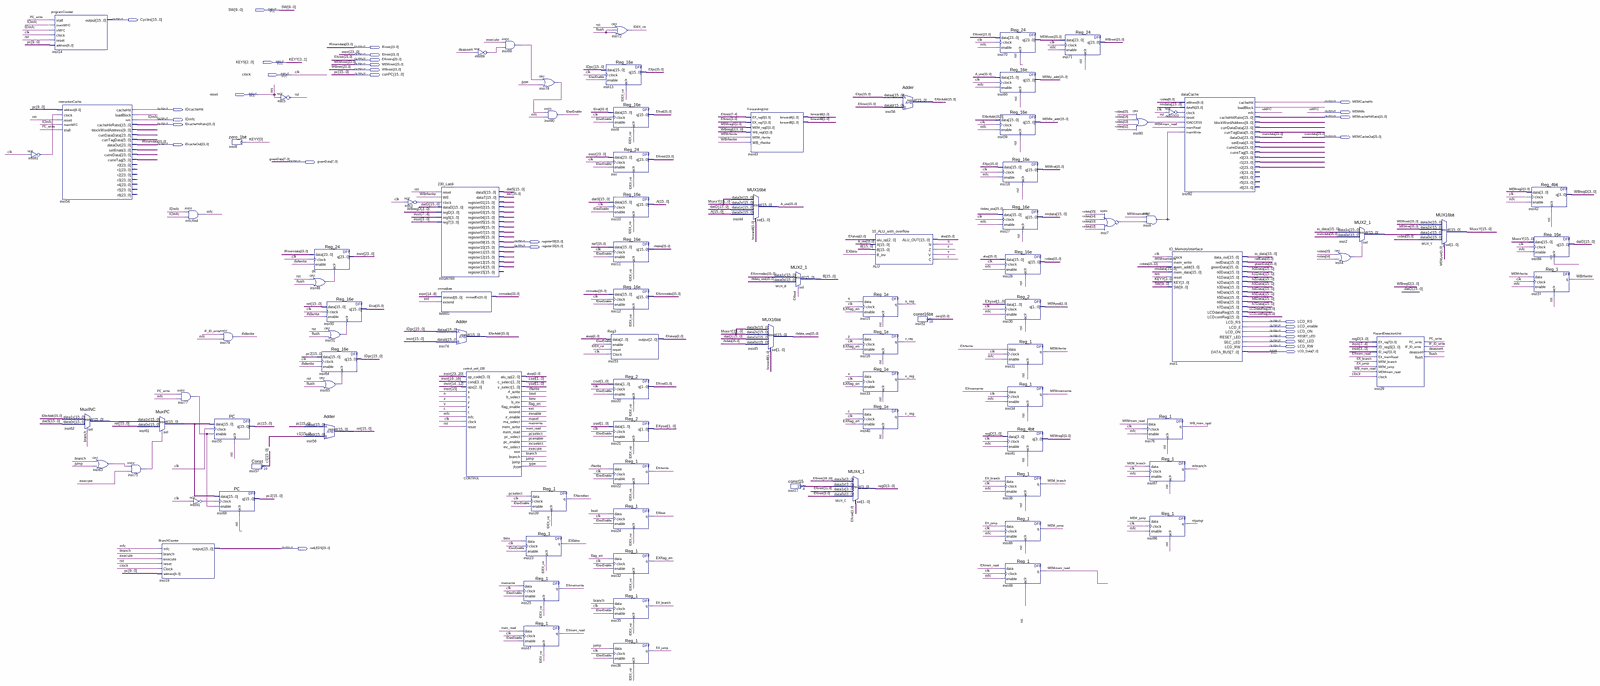
[diagram p0: schematic sheet, whole]
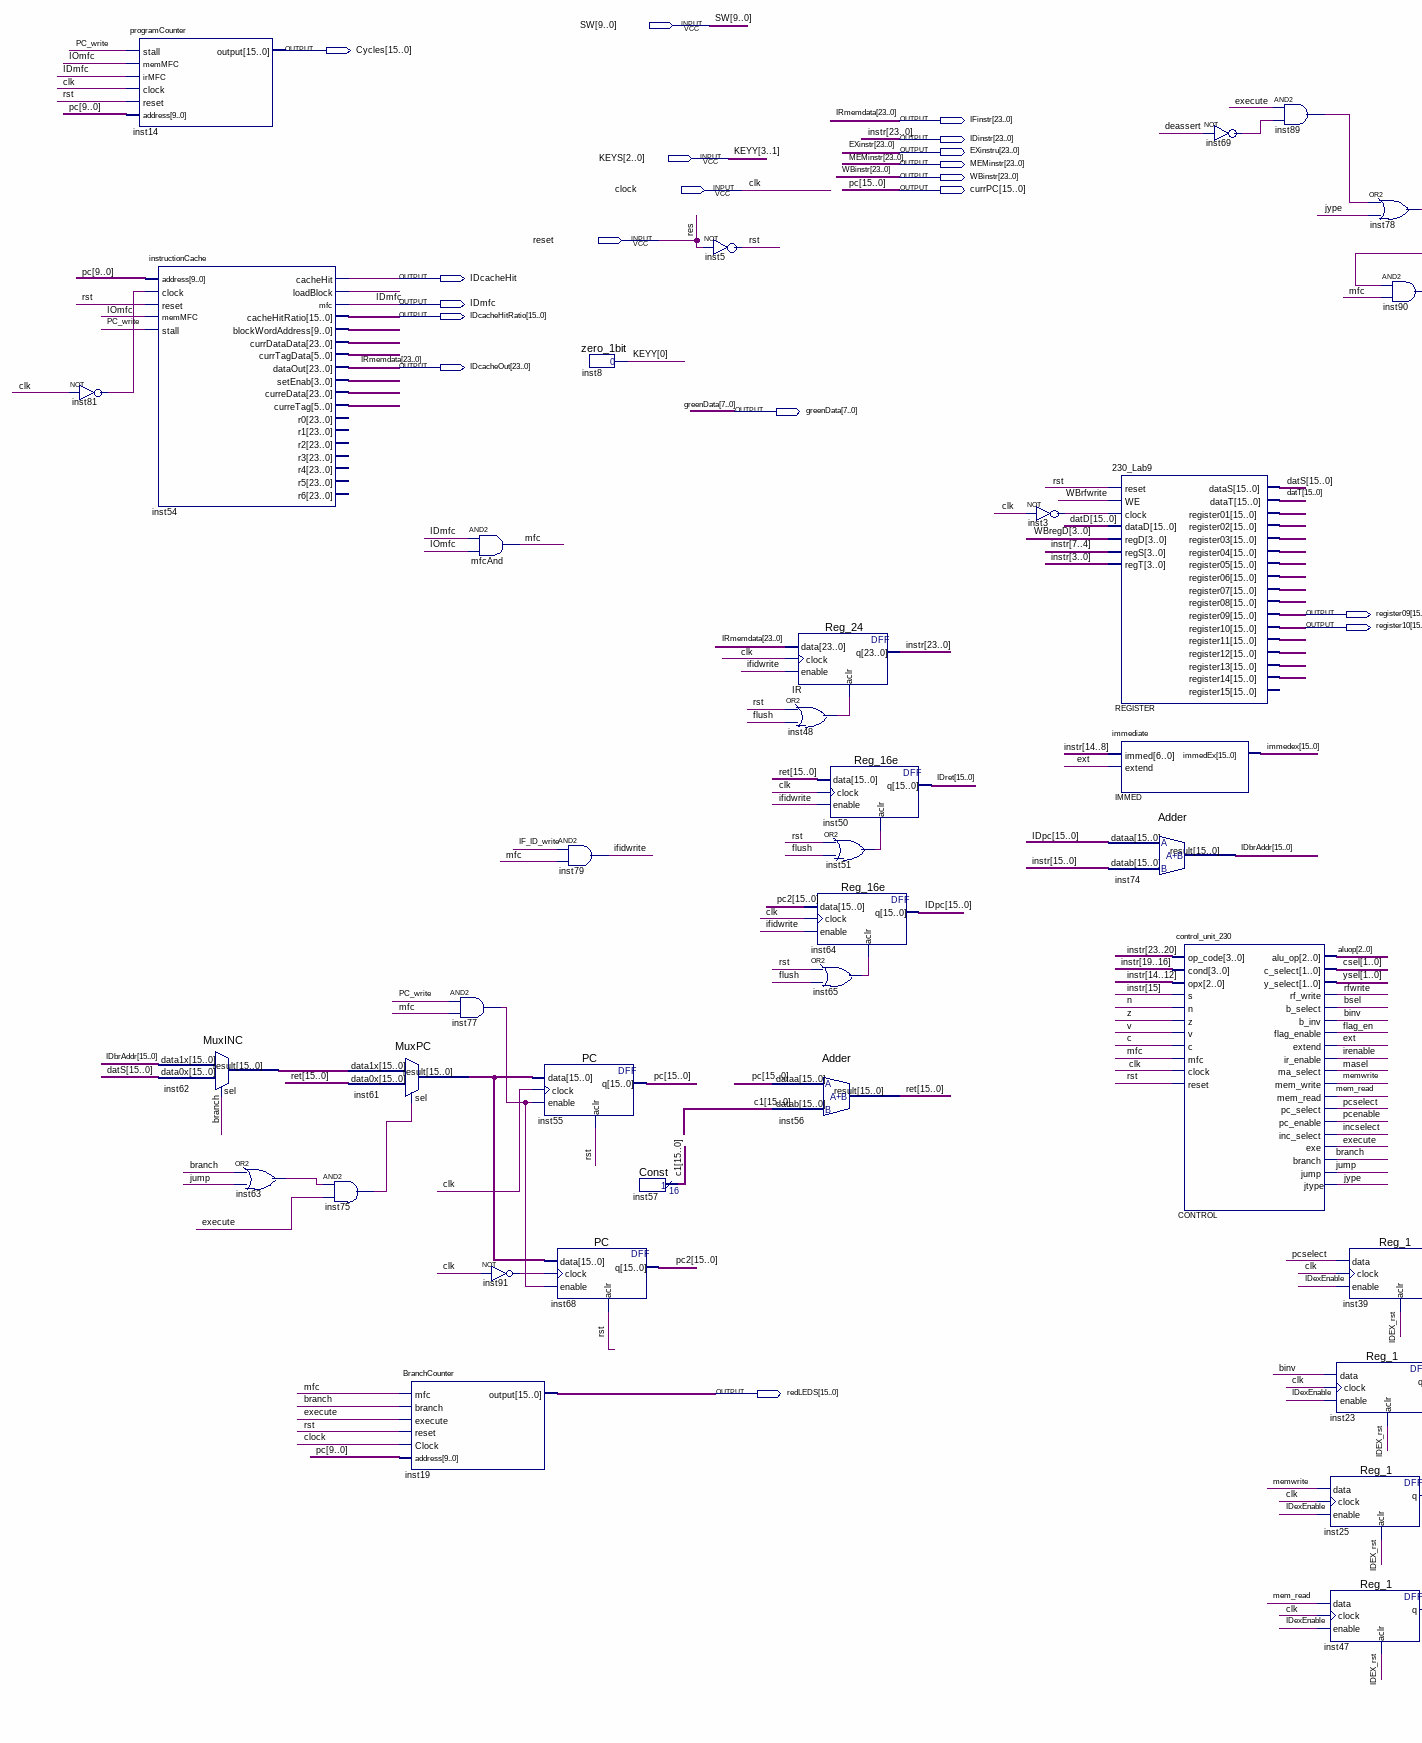
[diagram p1: schematic sheet, left part]
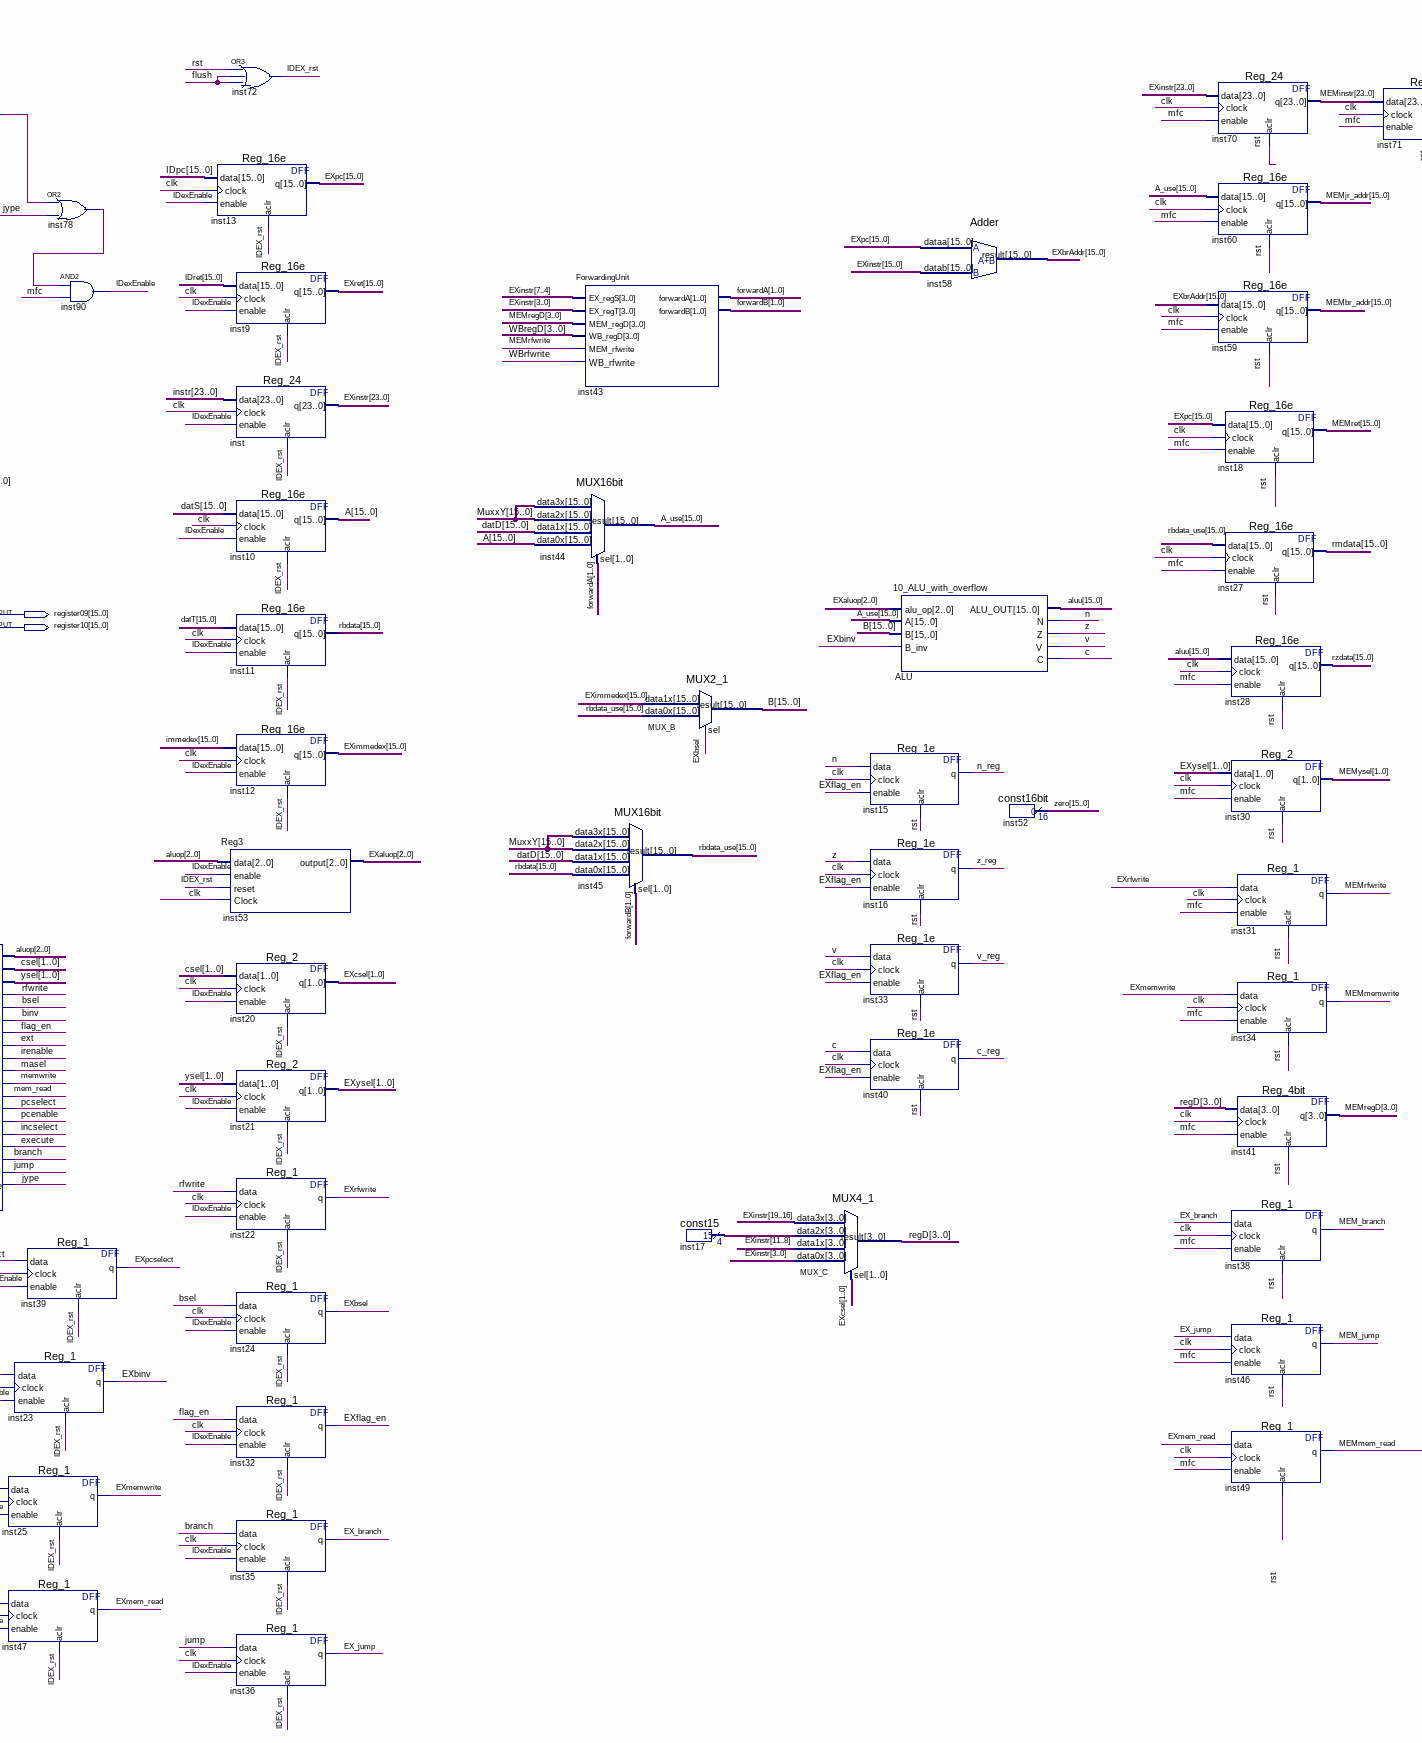
[diagram p2: schematic sheet, centre part]
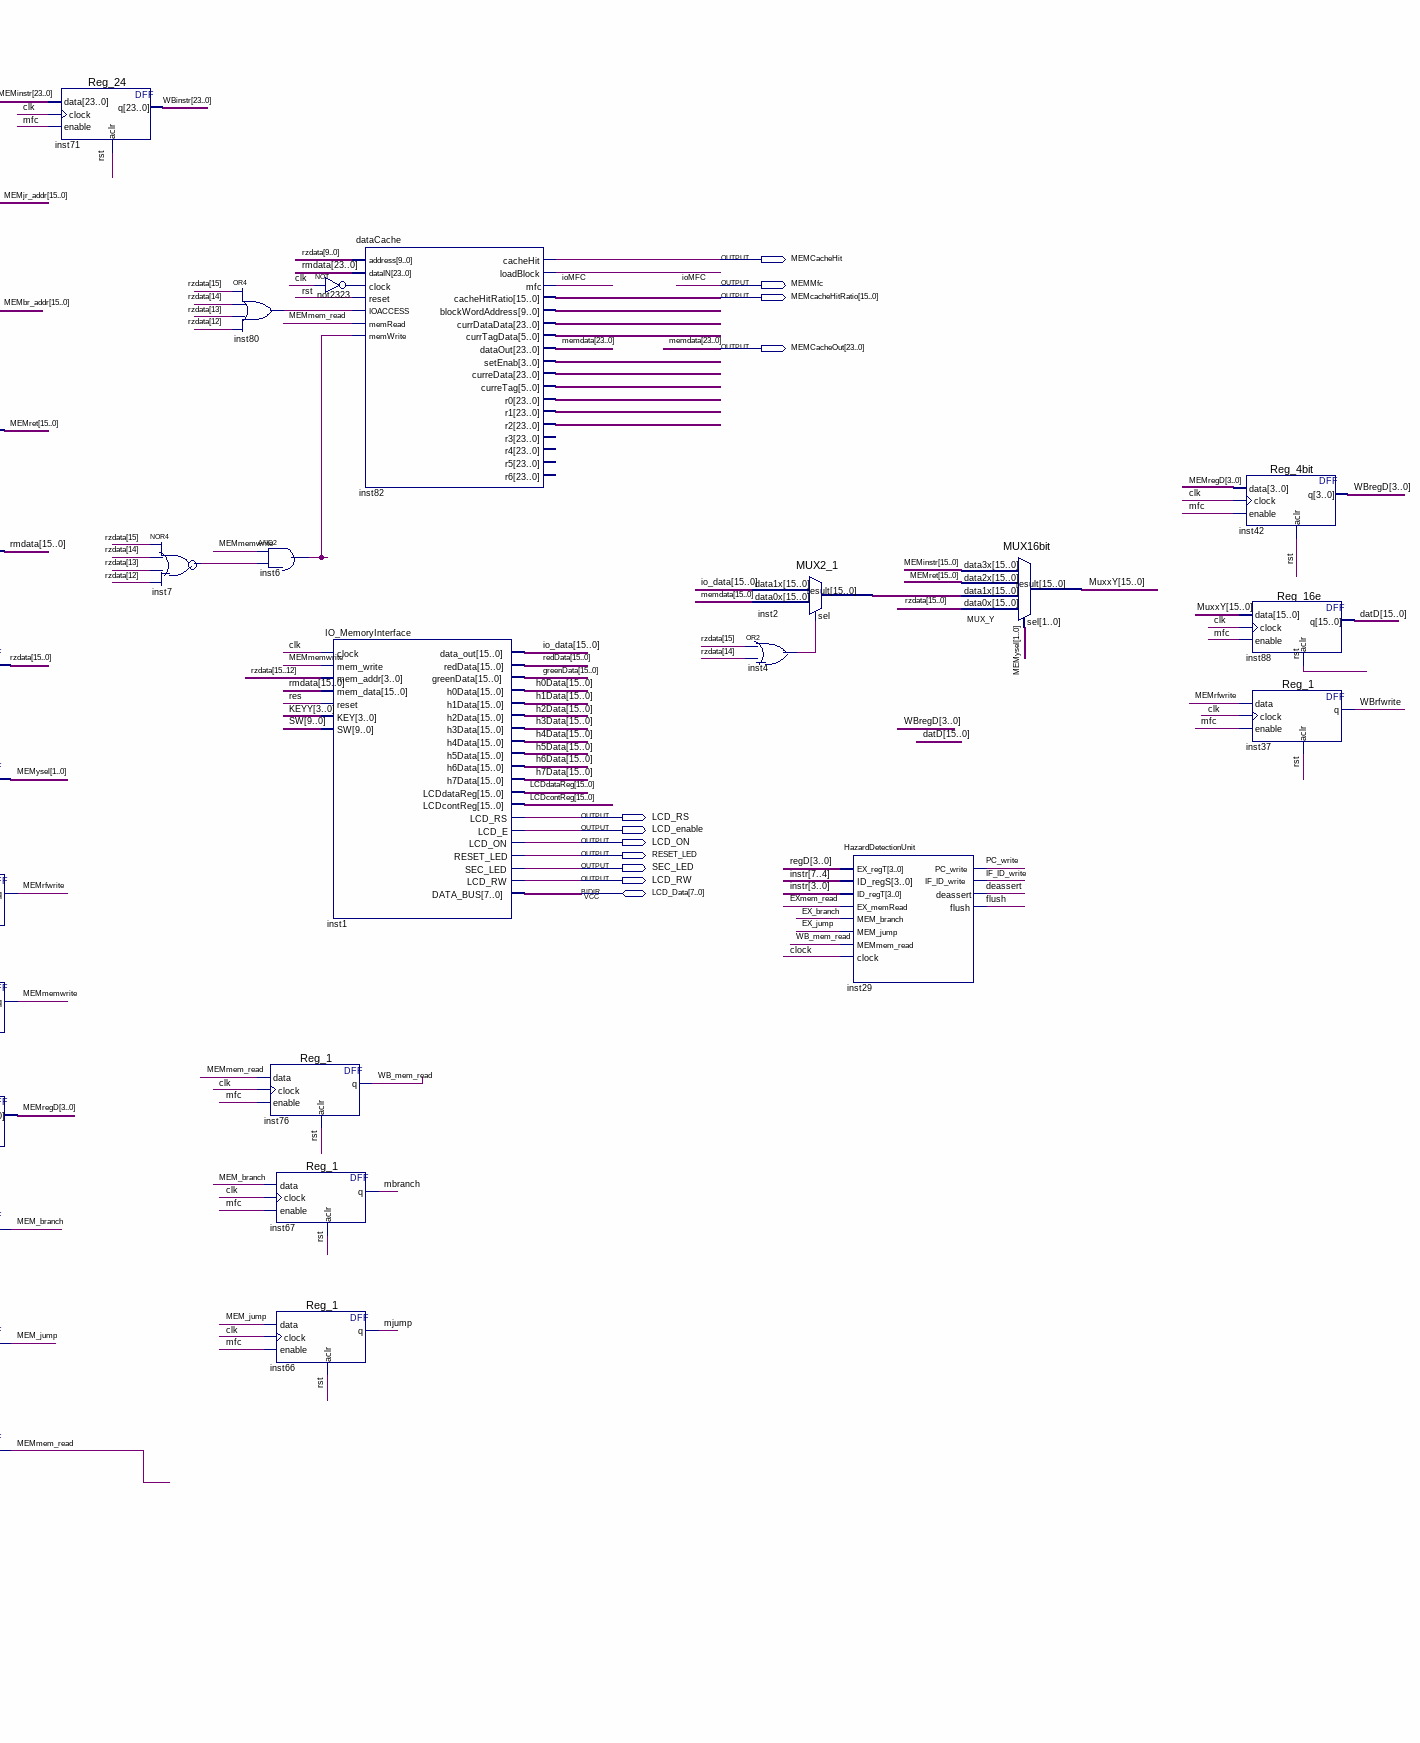
[diagram p3: schematic sheet, right part]
// Quartus schematic processor.bdf as structural Verilog: 95 symbols, 30 pins
module processor (
  input  [9:0] SW,
  input  [2:0] KEYS,
  input  clock,
  input  reset,
  inout  [7:0] LCD_Data,
  output [15:0] Cycles,
  output [23:0] IFinstr,
  output [23:0] IDinstr,
  output [23:0] EXinstru,
  output [23:0] MEMinstr,
  output [23:0] WBinstr,
  output [15:0] currPC,
  output MEMCacheHit,
  output IDcacheHit,
  output MEMMfc,
  output [15:0] MEMcacheHitRatio,
  output IDmfc,
  output [15:0] IDcacheHitRatio,
  output [23:0] MEMCacheOut,
  output [23:0] IDcacheOut,
  output [15:0] greenData,
  output [15:0] register09,
  output [15:0] register10,
  output LCD_RS,
  output LCD_enable,
  output LCD_ON,
  output RESET_LED,
  output SEC_LED,
  output LCD_RW,
  output [15:0] redLEDS
);

  wire binv, branch, bsel, c, c_reg, deassert, EX_branch, EX_jump, EXbinv, EXbsel, execute, EXflag_en,
       EXmem_read, EXmemwrite, EXpcselect, EXrfwrite, ext, flag_en, flush, IDEX_rst, IDexEnable, IF_ID_write,
       ifidwrite, incselect, inst3_out, inst4_out, inst6_out, inst7_out, inst48_out, inst51_out,
       inst54_loadblock, inst63_out, inst65_out, inst69_out, inst75_out, inst77_out, inst78_out, inst80_out,
       inst81_out, inst82_loadblock, inst89_out, inst91_out, irenable, jump, jype, masel, mbranch,
       MEM_branch, MEM_jump, mem_read, MEMmem_read, MEMmemwrite, MEMrfwrite, memwrite, mfc, mjump, n, n_reg,
       not2323_out, PC_write, pcenable, pcselect, rfwrite, rst, v, v_reg, WB_mem_read, WBrfwrite, z, z_reg;
  wire [0:0] KEYY;
  wire [1:0] csel, EXcsel, EXysel, forwardA, forwardB, MEMysel, ysel;
  wire [2:0] aluop, EXaluop;
  wire [3:0] inst17_result, inst54_setenab, inst82_setenab, MEMregD, regD, WBregD;
  wire [5:0] inst54_curretag, inst54_currtagdata, inst82_curretag, inst82_currtagdata;
  wire [9:0] inst54_blockwordaddress, inst82_blockwordaddress;
  wire [15:0] A, A_use, aluu, B, c1, datD, datS, datT, EXbrAddr, EXimmedex, EXpc, EXret, h0Data, h1Data,
       h2Data, h3Data, h4Data, h5Data, h6Data, h7Data, IDbrAddr, IDpc, IDret, immedex, inst2_result,
       inst61_result, inst62_result, io_data, LCDcontReg, LCDdataReg, MEMbr_addr, MEMjr_addr, MEMret, MuxxY,
       pc2, rbdata, rbdata_use, redData, REGISTER_register01, REGISTER_register02, REGISTER_register03,
       REGISTER_register04, REGISTER_register05, REGISTER_register06, REGISTER_register07,
       REGISTER_register08, REGISTER_register11, REGISTER_register12, REGISTER_register13,
       REGISTER_register14, ret, rzdata, zero;
  wire [23:0] inst54_currdatadata, inst54_curredata, inst82_currdatadata, inst82_curredata, inst82_r0,
       inst82_r1, inst82_r2, rmdata;

  not inst81 (inst81_out, clock);
  programCounter inst14 (
    .stall(PC_write), .memMFC(MEMMfc), .irMFC(IDmfc), .clock(clock), .reset(rst), .address(currPC[9:0]),
    .\output (Cycles));
  instructionCache inst54 (
    .address(currPC[9:0]), .clock(inst81_out), .reset(rst), .memMFC(MEMMfc), .stall(PC_write),
    .cacheHit(IDcacheHit), .loadBlock(inst54_loadblock), .mfc(IDmfc), .cacheHitRatio(IDcacheHitRatio),
    .blockWordAddress(inst54_blockwordaddress), .currDataData(inst54_currdatadata),
    .currTagData(inst54_currtagdata), .dataOut(IDcacheOut), .setEnab(inst54_setenab),
    .curreData(inst54_curredata), .curreTag(inst54_curretag));  // open: r0, r1, r2, r3, r4, r5, r6
  MuxINC inst62 (.data1x(IDbrAddr), .data0x(datS), .sel(branch), .result(inst62_result));
  or inst63 (inst63_out, branch, jump);
  and inst75 (inst75_out, inst63_out, execute);
  MuxPC inst61 (.data1x(inst62_result), .data0x(ret), .sel(inst75_out), .result(inst61_result));
  BranchCounter inst19 (
    .mfc(mfc), .branch(branch), .execute(execute), .reset(rst), .Clock(clock), .address(currPC[9:0]),
    .\output (redLEDS));
  and mfcAnd (mfc, IDmfc, MEMMfc);
  and inst77 (inst77_out, PC_write, mfc);
  not inst91 (inst91_out, clock);
  PC inst55 (.data(inst61_result), .clock(clock), .enable(inst77_out), .aclr(rst), .q(currPC));
  PC inst68 (.data(inst61_result), .clock(inst91_out), .enable(inst77_out), .aclr(rst), .q(pc2));
  zero_1bit inst8 (.result(KEYY[0]));
  and inst79 (ifidwrite, IF_ID_write, mfc);
  Const inst57 (.result(c1));
  not inst5 (rst, reset);
  Reg_24 IR (.data(IDcacheOut), .clock(clock), .enable(ifidwrite), .aclr(inst48_out), .q(IDinstr));
  or inst48 (inst48_out, rst, flush);
  Adder inst56 (.dataa(currPC), .datab(c1), .result(ret));
  Reg_16e inst50 (.data(ret), .clock(clock), .enable(ifidwrite), .aclr(inst51_out), .q(IDret));
  or inst51 (inst51_out, rst, flush);
  Reg_16e inst64 (.data(pc2), .clock(clock), .enable(ifidwrite), .aclr(inst65_out), .q(IDpc));
  or inst65 (inst65_out, rst, flush);
  not inst3 (inst3_out, clock);
  \230_Lab9  REGISTER (
    .reset(rst), .WE(WBrfwrite), .clock(inst3_out), .dataD(datD), .regD(WBregD), .regS(IDinstr[7:4]),
    .regT(IDinstr[3:0]), .dataS(datS), .dataT(datT), .register01(REGISTER_register01),
    .register02(REGISTER_register02), .register03(REGISTER_register03), .register04(REGISTER_register04),
    .register05(REGISTER_register05), .register06(REGISTER_register06), .register07(REGISTER_register07),
    .register08(REGISTER_register08), .register09(register09), .register10(register10),
    .register11(REGISTER_register11), .register12(REGISTER_register12), .register13(REGISTER_register13),
    .register14(REGISTER_register14));  // open: register15
  immediate IMMED (.immed(IDinstr[14:8]), .extend(ext), .immedEx(immedex));
  Adder inst74 (.dataa(IDpc), .datab(IDinstr[15:0]), .result(IDbrAddr));
  not inst69 (inst69_out, deassert);
  control_unit_230 CONTROL (
    .op_code(IDinstr[23:20]), .cond(IDinstr[19:16]), .opx(IDinstr[14:12]), .s(IDinstr[15]), .n(n), .z(z),
    .v(v), .c(c), .mfc(mfc), .clock(clock), .reset(rst), .alu_op(aluop), .c_select(csel), .y_select(ysel),
    .rf_write(rfwrite), .b_select(bsel), .b_inv(binv), .flag_enable(flag_en), .extend(ext),
    .ir_enable(irenable), .ma_select(masel), .mem_write(memwrite), .mem_read(mem_read), .pc_select(pcselect),
    .pc_enable(pcenable), .inc_select(incselect), .exe(execute), .branch(branch), .jump(jump), .jtype(jype));
  and inst89 (inst89_out, execute, inst69_out);
  Reg_1 inst39 (.data(pcselect), .clock(clock), .enable(IDexEnable), .aclr(IDEX_rst), .q(EXpcselect));
  Reg_1 inst23 (.data(binv), .clock(clock), .enable(IDexEnable), .aclr(IDEX_rst), .q(EXbinv));
  Reg_1 inst25 (.data(memwrite), .clock(clock), .enable(IDexEnable), .aclr(IDEX_rst), .q(EXmemwrite));
  Reg_1 inst47 (.data(mem_read), .clock(clock), .enable(IDexEnable), .aclr(IDEX_rst), .q(EXmem_read));
  or inst78 (inst78_out, inst89_out, jype);
  and inst90 (IDexEnable, inst78_out, mfc);
  or inst72 (IDEX_rst, rst, flush, flush);
  Reg_16e inst13 (.data(IDpc), .clock(clock), .enable(IDexEnable), .aclr(IDEX_rst), .q(EXpc));
  Reg_16e inst9 (.data(IDret), .clock(clock), .enable(IDexEnable), .aclr(IDEX_rst), .q(EXret));
  Reg_24 inst (.data(IDinstr), .clock(clock), .enable(IDexEnable), .aclr(IDEX_rst), .q(EXinstru));
  Reg_16e inst10 (.data(datS), .clock(clock), .enable(IDexEnable), .aclr(IDEX_rst), .q(A));
  Reg_16e inst11 (.data(datT), .clock(clock), .enable(IDexEnable), .aclr(IDEX_rst), .q(rbdata));
  Reg_16e inst12 (.data(immedex), .clock(clock), .enable(IDexEnable), .aclr(IDEX_rst), .q(EXimmedex));
  Reg3 inst53 (.data(aluop), .enable(IDexEnable), .reset(IDEX_rst), .Clock(clock), .\output (EXaluop));
  Reg_2 inst20 (.data(csel), .clock(clock), .enable(IDexEnable), .aclr(IDEX_rst), .q(EXcsel));
  Reg_2 inst21 (.data(ysel), .clock(clock), .enable(IDexEnable), .aclr(IDEX_rst), .q(EXysel));
  Reg_1 inst22 (.data(rfwrite), .clock(clock), .enable(IDexEnable), .aclr(IDEX_rst), .q(EXrfwrite));
  Reg_1 inst24 (.data(bsel), .clock(clock), .enable(IDexEnable), .aclr(IDEX_rst), .q(EXbsel));
  Reg_1 inst32 (.data(flag_en), .clock(clock), .enable(IDexEnable), .aclr(IDEX_rst), .q(EXflag_en));
  Reg_1 inst35 (.data(branch), .clock(clock), .enable(IDexEnable), .aclr(IDEX_rst), .q(EX_branch));
  Reg_1 inst36 (.data(jump), .clock(clock), .enable(IDexEnable), .aclr(IDEX_rst), .q(EX_jump));
  MUX16bit inst44 (.data3x(MuxxY), .data2x(MuxxY), .data1x(datD), .data0x(A), .sel(forwardA), .result(A_use));
  ForwardingUnit inst43 (
    .EX_regS(EXinstru[7:4]), .EX_regT(EXinstru[3:0]), .MEM_regD(MEMregD), .WB_regD(WBregD),
    .MEM_rfwrite(MEMrfwrite), .WB_rfwrite(WBrfwrite), .forwardA(forwardA), .forwardB(forwardB));
  MUX16bit inst45 (.data3x(MuxxY), .data2x(MuxxY), .data1x(datD), .data0x(rbdata), .sel(forwardB), .result(rbdata_use));
  MUX2_1 MUX_B (.data1x(EXimmedex), .data0x(rbdata_use), .sel(EXbsel), .result(B));
  const15 inst17 (.result(inst17_result));
  MUX4_1 MUX_C (
    .data3x(EXinstru[19:16]), .data2x(inst17_result), .data1x(EXinstru[11:8]), .data0x(EXinstru[3:0]),
    .sel(EXcsel), .result(regD));
  \10_ALU_with_overflow  ALU (
    .alu_op(EXaluop), .A(A_use), .B(B), .B_inv(EXbinv), .ALU_OUT(aluu), .N(n), .Z(z), .V(v), .C(c));
  Reg_1e inst15 (.data(n), .clock(clock), .enable(EXflag_en), .aclr(rst), .q(n_reg));
  Reg_1e inst16 (.data(z), .clock(clock), .enable(EXflag_en), .aclr(rst), .q(z_reg));
  Reg_1e inst33 (.data(v), .clock(clock), .enable(EXflag_en), .aclr(rst), .q(v_reg));
  Reg_1e inst40 (.data(c), .clock(clock), .enable(EXflag_en), .aclr(rst), .q(c_reg));
  Adder inst58 (.dataa(EXpc), .datab(EXinstru[15:0]), .result(EXbrAddr));
  const16bit inst52 (.result(zero));
  Reg_24 inst70 (.data(EXinstru), .clock(clock), .enable(mfc), .aclr(rst), .q(MEMinstr));
  Reg_16e inst60 (.data(A_use), .clock(clock), .enable(mfc), .aclr(rst), .q(MEMjr_addr));
  Reg_16e inst59 (.data(EXbrAddr), .clock(clock), .enable(mfc), .aclr(rst), .q(MEMbr_addr));
  Reg_16e inst18 (.data(EXpc), .clock(clock), .enable(mfc), .aclr(rst), .q(MEMret));
  Reg_16e inst27 (.data(rbdata_use), .clock(clock), .enable(mfc), .aclr(rst), .q(rmdata[15:0]));
  Reg_16e inst28 (.data(aluu), .clock(clock), .enable(mfc), .aclr(rst), .q(rzdata));
  Reg_2 inst30 (.data(EXysel), .clock(clock), .enable(mfc), .aclr(rst), .q(MEMysel));
  Reg_1 inst31 (.data(EXrfwrite), .clock(clock), .enable(mfc), .aclr(rst), .q(MEMrfwrite));
  Reg_1 inst34 (.data(EXmemwrite), .clock(clock), .enable(mfc), .aclr(rst), .q(MEMmemwrite));
  Reg_4bit inst41 (.data(regD), .clock(clock), .enable(mfc), .aclr(rst), .q(MEMregD));
  Reg_1 inst38 (.data(EX_branch), .clock(clock), .enable(mfc), .aclr(rst), .q(MEM_branch));
  Reg_1 inst46 (.data(EX_jump), .clock(clock), .enable(mfc), .aclr(rst), .q(MEM_jump));
  Reg_1 inst49 (.data(EXmem_read), .clock(clock), .enable(mfc), .aclr(rst), .q(MEMmem_read));
  Reg_24 inst71 (.data(MEMinstr), .clock(clock), .enable(mfc), .aclr(rst), .q(WBinstr));
  nor inst7 (inst7_out, rzdata[15], rzdata[14], rzdata[13], rzdata[12]);
  or inst80 (inst80_out, rzdata[15], rzdata[14], rzdata[13], rzdata[12]);
  and inst6 (inst6_out, MEMmemwrite, inst7_out);
  Reg_1 inst76 (.data(MEMmem_read), .clock(clock), .enable(mfc), .aclr(rst), .q(WB_mem_read));
  Reg_1 inst67 (.data(MEM_branch), .clock(clock), .enable(mfc), .aclr(rst), .q(mbranch));
  Reg_1 inst66 (.data(MEM_jump), .clock(clock), .enable(mfc), .aclr(rst), .q(mjump));
  not not2323 (not2323_out, clock);
  IO_MemoryInterface inst1 (
    .clock(clock), .mem_write(MEMmemwrite), .mem_addr(rzdata[15:12]), .mem_data(rmdata[15:0]), .reset(reset),
    .KEY({KEYS, KEYY[0]}), .SW(SW), .data_out(io_data), .redData(redData), .greenData(greenData),
    .h0Data(h0Data), .h1Data(h1Data), .h2Data(h2Data), .h3Data(h3Data), .h4Data(h4Data), .h5Data(h5Data),
    .h6Data(h6Data), .h7Data(h7Data), .LCDdataReg(LCDdataReg), .LCDcontReg(LCDcontReg), .LCD_RS(LCD_RS),
    .LCD_E(LCD_enable), .LCD_ON(LCD_ON), .RESET_LED(RESET_LED), .SEC_LED(SEC_LED), .LCD_RW(LCD_RW),
    .DATA_BUS(LCD_Data));
  dataCache inst82 (
    .address(rzdata[9:0]), .dataIN(rmdata), .clock(not2323_out), .reset(rst), .IOACCESS(inst80_out),
    .memRead(MEMmem_read), .memWrite(inst6_out), .cacheHit(MEMCacheHit), .loadBlock(inst82_loadblock),
    .mfc(MEMMfc), .cacheHitRatio(MEMcacheHitRatio), .blockWordAddress(inst82_blockwordaddress),
    .currDataData(inst82_currdatadata), .currTagData(inst82_currtagdata), .dataOut(MEMCacheOut),
    .setEnab(inst82_setenab), .curreData(inst82_curredata), .curreTag(inst82_curretag), .r0(inst82_r0),
    .r1(inst82_r1), .r2(inst82_r2));  // open: r3, r4, r5, r6
  MUX2_1 inst2 (.data1x(io_data), .data0x(MEMCacheOut[15:0]), .sel(inst4_out), .result(inst2_result));
  or inst4 (inst4_out, rzdata[15], rzdata[14]);
  HazardDetectionUnit inst29 (
    .EX_regT(regD), .ID_regS(IDinstr[7:4]), .ID_regT(IDinstr[3:0]), .EX_memRead(EXmem_read),
    .MEM_branch(EX_branch), .MEM_jump(EX_jump), .MEMmem_read(WB_mem_read), .clock(clock),
    .PC_write(PC_write), .IF_ID_write(IF_ID_write), .deassert(deassert), .flush(flush));
  MUX16bit MUX_Y (
    .data3x(MEMinstr[15:0]), .data2x(MEMret), .data1x(inst2_result), .data0x(rzdata), .sel(MEMysel),
    .result(MuxxY));
  Reg_4bit inst42 (.data(MEMregD), .clock(clock), .enable(mfc), .aclr(rst), .q(WBregD));
  Reg_16e inst88 (.data(MuxxY), .clock(clock), .enable(mfc), .aclr(rst), .q(datD));
  Reg_1 inst37 (.data(MEMrfwrite), .clock(clock), .enable(mfc), .aclr(rst), .q(WBrfwrite));

  assign IFinstr = IDcacheOut;

  // Other names for the same wires on the sheet: clk = clock; EXinstr[23:0] = EXinstru; instr[23:0] = IDinstr;
  //   ioMFC = MEMMfc; IRmemdata[23:0] = IDcacheOut; KEYY[3:1] = KEYS; memdata[23:0] = MEMCacheOut; pc[15:0] = currPC;
  //   res = reset
endmodule
